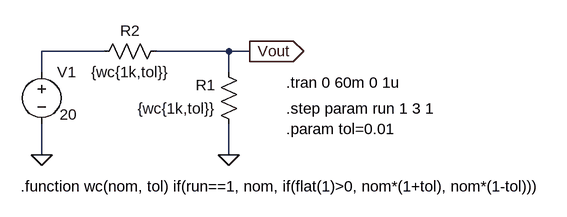
[diagram p0: schematic VoltageDividerWC.asc]
VoltageDividerWC.asc, the LTspice schematic file:
Version 4
SHEET 1 1220 680
WIRE 80 -160 -16 -160
WIRE 272 -160 160 -160
WIRE 304 -160 272 -160
WIRE -16 -128 -16 -160
WIRE 272 -128 272 -160
WIRE -16 0 -16 -48
WIRE 272 0 272 -48
FLAG -16 0 0
FLAG 272 0 0
FLAG 304 -160 Vout
IOPIN 304 -160 Out
SYMBOL res 176 -176 R90
WINDOW 0 0 56 VBottom 2
WINDOW 3 32 56 VTop 2
SYMATTR InstName R2
SYMATTR Value {wc{1k,tol}}
SYMATTR SpiceLine tol=5
SYMBOL voltage -16 -144 R0
WINDOW 3 28 81 Left 2
WINDOW 123 8 98 Left 2
WINDOW 39 0 0 Left 2
SYMATTR Value 20
SYMATTR InstName V1
SYMBOL res 288 -32 R180
WINDOW 0 36 76 Left 2
WINDOW 3 36 40 Left 2
SYMATTR InstName R1
SYMATTR Value {wc{1k,tol}}
TEXT 360 -112 Left 2 !.tran 0 60m 0 1u
TEXT 360 -72 Left 2 !.step param run 1 3 1
TEXT 360 -40 Left 2 !.param tol=0.01
TEXT -48 48 Left 2 !.function wc(nom, tol) if(run==1, nom, if(flat(1)>0, nom*(1+tol), nom*(1-tol)))

The netlist it stands for:
* VoltageDividerWC.asc
R2 Vout N001 {wc{1k,tol}} tol=5
V1 N001 0 20
R1 0 Vout {wc{1k,tol}}
.tran 0 60m 0 1u
.step param run 1 3 1
.param tol=0.01
.function wc(nom, tol) if(run==1, nom, if(flat(1)>0, nom*(1+tol), nom*(1-tol)))
.backanno
.end

* Results of the author's LTspice run, read from the files saved beside the schematic
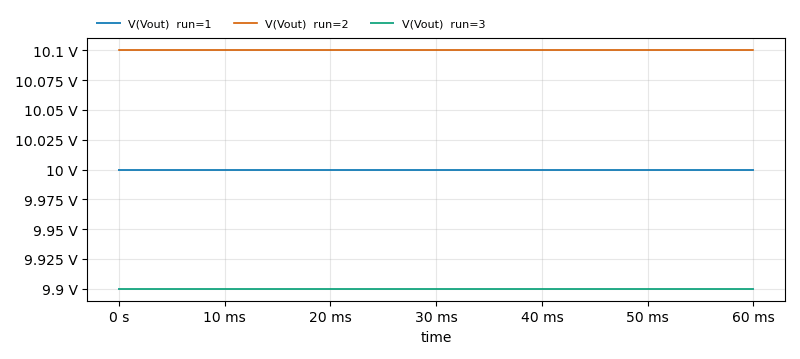
[diagram p1: Transient Analysis of VoltageDividerWC.asc, plotted from the saved traces]
* Transient Analysis, 3 runs:
*   V(Vout) [run=1]: min 10 V, max 10 V, average 10 V, rms 10 V, last 10 V
*   V(Vout) [run=2]: min 10.1 V, max 10.1 V, average 10.1 V, rms 10.1 V, last 10.1 V
*   V(Vout) [run=3]: min 9.9 V, max 9.9 V, average 9.9 V, rms 9.9 V, last 9.9 V